# Altium project bbr18_wheel_motor_connector_board.PrjPCB
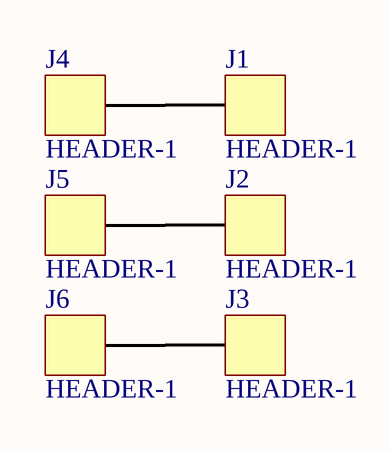
[diagram p0: bbr18_wheel_motor_connector_board.SchDoc]
1 sheet, 6 parts. Net scope: global (net labels, ports and power ports of the same name join across sheets).
Board file: bbr18_wheel_motor_connector_board.PcbDoc

## Sheet bbr18_wheel_motor_connector_board.SchDoc
size A4

### Parts
J1  HEADER-1  [2MM-BULLET-PLUG-VIA]
J2  HEADER-1  [2MM-BULLET-PLUG-VIA]
J3  HEADER-1  [2MM-BULLET-PLUG-VIA]
J4  HEADER-1  [POWER-PAD-4x3]
J5  HEADER-1  [POWER-PAD-4x3]
J6  HEADER-1  [POWER-PAD-4x3]

### Nets
NetJ1_1: J1.1 J4.1
NetJ2_1: J2.1 J5.1
NetJ3_1: J3.1 J6.1